# Altium schematic sheet TopSheet.SchDoc: TopSheet
size A4; DrawnBy: Hüseyin; Organization: Altium Limited; Address1: L3, 12a Rodborough Rd; Address2: Frenchs Forest; Address3: NSW; Address4: Australia 2086; Revision: 1; SheetNumber: 1; SheetTotal: 3
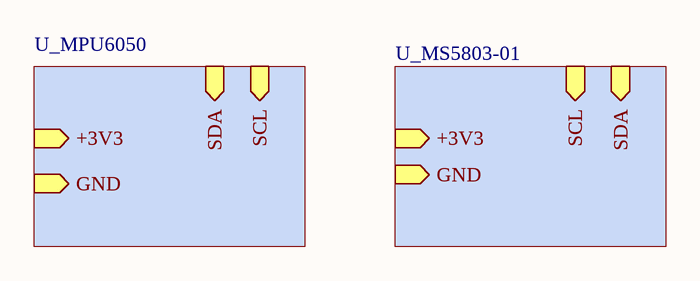
[diagram p0: TopSheet.SchDoc]

## Sub-sheets
U_MPU6050 = MPU6050.SchDoc: GND (in), +3V3 (in), SDA (in), SCL (in)
U_MS5803-01 = MS5803-01.BA.SchDoc: SDA (in), SCL (in), GND (in), +3V3 (in)

## Notes on the sheet
- Size:
- Title
- A4
- DrawnBy
- Revision:
- YBU
- Batı Kampüsü
- Etlik Keçiören
- Date:
- Time:
- Sheet
- of
- Ankara / Türkiye